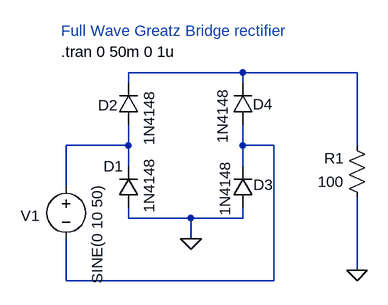
[diagram p0: schematic Greatzbridge.asc]
Greatzbridge.asc, the LTspice schematic file:
Version 4
SHEET 1 880 720
WIRE 192 224 16 224
WIRE 368 224 192 224
WIRE 16 240 16 224
WIRE 192 240 192 224
WIRE 16 336 16 304
WIRE 16 336 -80 336
WIRE 192 336 192 304
WIRE 240 336 192 336
WIRE 368 336 368 224
WIRE 16 368 16 336
WIRE 192 368 192 336
WIRE -80 400 -80 336
WIRE 16 448 16 432
WIRE 112 448 16 448
WIRE 192 448 192 432
WIRE 192 448 112 448
WIRE 112 480 112 448
WIRE 368 528 368 416
WIRE -80 544 -80 480
WIRE 240 544 240 336
WIRE 240 544 -80 544
FLAG 368 528 0
FLAG 112 480 0
SYMBOL diode 32 432 R180
WINDOW 0 24 64 Left 2
WINDOW 3 -16 -8 VRight 2
SYMATTR InstName D1
SYMATTR Value 1N4148
SYMBOL voltage -80 384 R0
WINDOW 0 -70 60 Left 2
WINDOW 3 48 13 VRight 2
WINDOW 123 0 0 Left 2
WINDOW 39 0 0 Left 2
SYMATTR InstName V1
SYMATTR Value SINE(0 10 50)
SYMBOL res 384 432 R180
WINDOW 0 36 76 Left 2
WINDOW 3 36 40 Left 2
SYMATTR InstName R1
SYMATTR Value 100
SYMBOL diode 32 304 R180
WINDOW 0 32 30 Left 2
WINDOW 3 -16 -32 VRight 2
SYMATTR InstName D2
SYMATTR Value 1N4148
SYMBOL diode 176 432 M180
WINDOW 0 32 35 Left 2
WINDOW 3 -11 72 VLeft 2
SYMATTR InstName D3
SYMATTR Value 1N4148
SYMBOL diode 208 304 R180
WINDOW 0 -30 31 Left 2
WINDOW 3 47 -29 VRight 2
SYMATTR InstName D4
SYMATTR Value 1N4148
TEXT -88 192 Left 2 !.tran 0 50m 0 1u
TEXT -88 160 Left 2 ;Full Wave Greatz Bridge rectifier

The netlist it stands for:
* Greatzbridge.asc
D1 0 N002 1N4148
V1 N002 N003 SINE(0 10 50)
R1 0 N001 100
D2 N002 N001 1N4148
D3 0 N003 1N4148
D4 N003 N001 1N4148
.model D D
.lib standard.dio
.tran 0 50m 0 1u
* Full Wave Greatz Bridge rectifier
.backanno
.end